# Altium project BraaiBuddyPCB.PrjPcb (part 2 of 2)
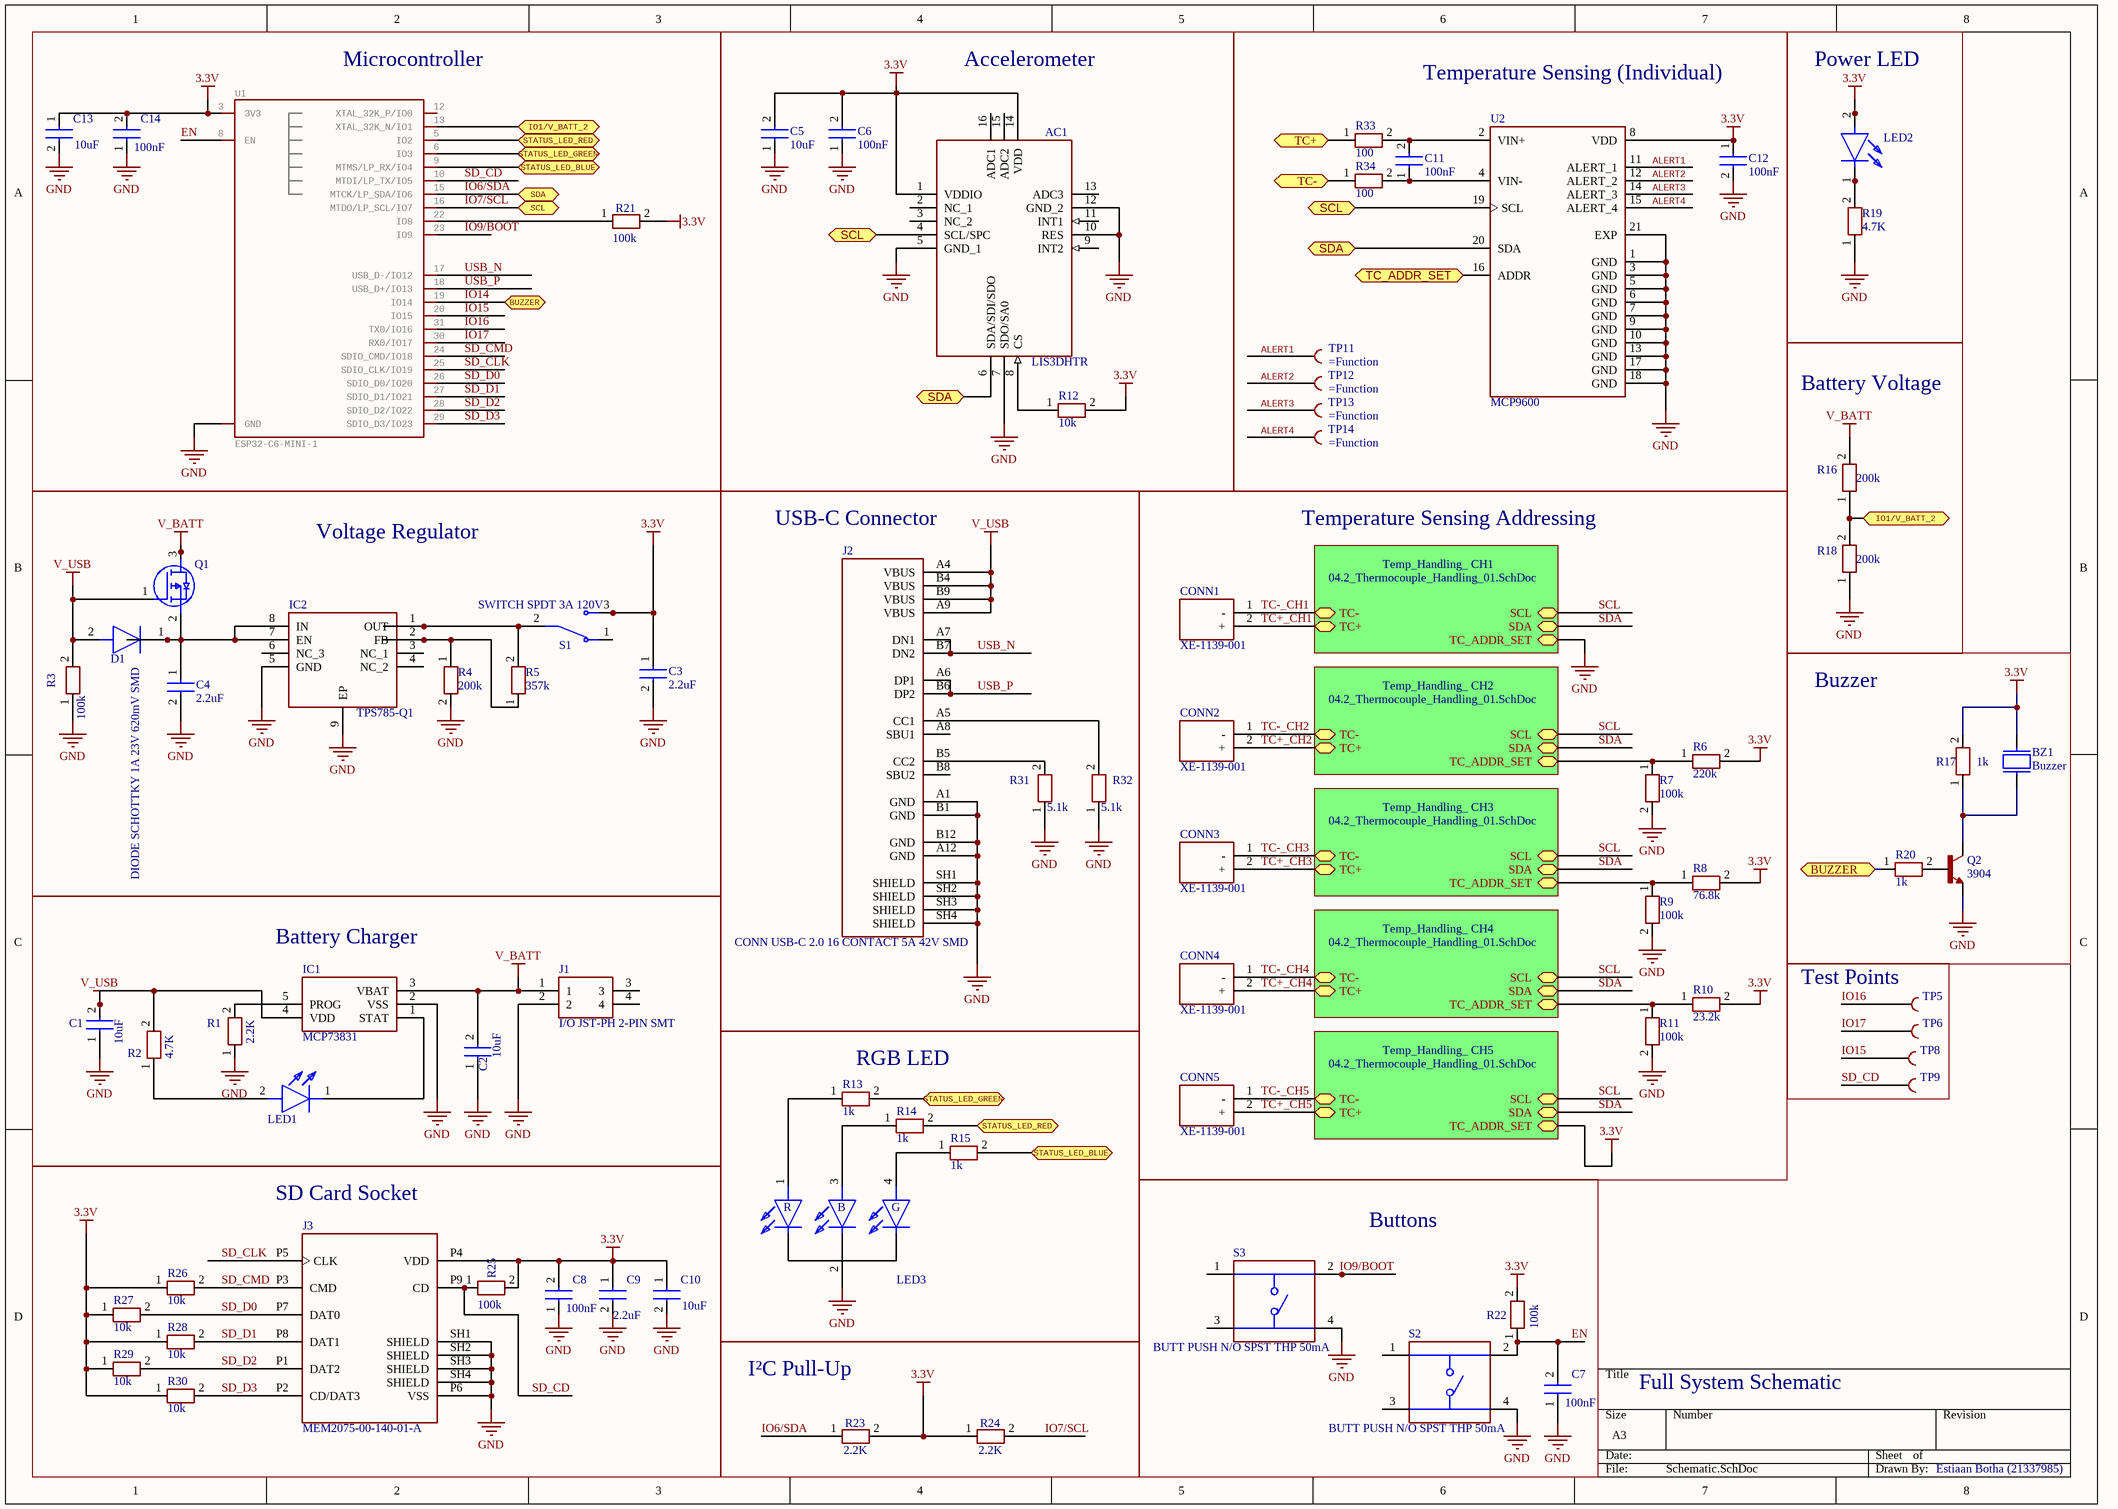
[diagram p9: Schematic.SchDoc]

## Nets that join several sheets
3.3V: 06_MCU (17 pins), 03_Temp_Sensor (R6#1.2 R8#1.2 R10#1.2), Temperature Sensor Interface/Temp_Handling_ CH1 (C12.1.1 U2.1.8), Temperature Sensor Interface/Temp_Handling_ CH2 (C12.2.1 U2.2.8), Temperature Sensor Interface/Temp_Handling_ CH3 (C12.3.1 U2.3.8), Temperature Sensor Interface/Temp_Handling_ CH4 (C12.4.1 U2.4.8), Temperature Sensor Interface/Temp_Handling_ CH5 (C12.5.1 U2.5.8 U2.5.16), 04_Accelerometer (5 pins), 02_Power (C3#1.1 S1#1.3), 05_Human_Interaction (BZ1#1.2 LED2#1.2 R17#1.2), Schematic (32 pins), Temp_Handling_ CH1 (C12.6.1 U2.6.8), Temp_Handling_ CH2 (C12.7.1 U2.7.8), Temp_Handling_ CH3 (C12.8.1 U2.8.8), Temp_Handling_ CH4 (C12.9.1 U2.9.8), Temp_Handling_ CH5 (C12.10.1 U2.10.8 U2.10.16)
GND: 06_MCU (24 pins), 03_Temp_Sensor (R7#1.2 R9#1.2 R11#1.2), Temperature Sensor Interface/Temp_Handling_ CH1 (13 pins), Temperature Sensor Interface/Temp_Handling_ CH2 (12 pins), Temperature Sensor Interface/Temp_Handling_ CH3 (12 pins), Temperature Sensor Interface/Temp_Handling_ CH4 (12 pins), Temperature Sensor Interface/Temp_Handling_ CH5 (12 pins), 04_Accelerometer (6 pins), 02_Power (11 pins), 05_Human_Interaction (LED3#1.2 Q2#1.E R18#1.1 R19#1.1), Schematic (60 pins), Temp_Handling_ CH1 (13 pins), Temp_Handling_ CH2 (12 pins), Temp_Handling_ CH3 (12 pins), Temp_Handling_ CH4 (12 pins), Temp_Handling_ CH5 (12 pins)
V_BATT: 02_Power (C2#1.2 IC1#1.3 J1#1.1 Q1#1.3), 05_Human_Interaction (R16#1.2), Schematic (5 pins)
V_USB: 06_MCU (J2#1.A4 J2#1.A9 J2#1.B4 J2#1.B9), 02_Power (6 pins), Schematic (10 pins)
IO6/SDA: 06_MCU (R23#1.1 U1#1.15), Temperature Sensor Interface/Temp_Handling_ CH1 (U2.1.20), Temperature Sensor Interface/Temp_Handling_ CH2 (U2.2.20), Temperature Sensor Interface/Temp_Handling_ CH3 (U2.3.20), Temperature Sensor Interface/Temp_Handling_ CH4 (U2.4.20), Temperature Sensor Interface/Temp_Handling_ CH5 (U2.5.20), 04_Accelerometer (AC1#1.6)
IO7/SCL: 06_MCU (R24#1.2 U1#1.16), Temperature Sensor Interface/Temp_Handling_ CH1 (U2.1.19), Temperature Sensor Interface/Temp_Handling_ CH2 (U2.2.19), Temperature Sensor Interface/Temp_Handling_ CH3 (U2.3.19), Temperature Sensor Interface/Temp_Handling_ CH4 (U2.4.19), Temperature Sensor Interface/Temp_Handling_ CH5 (U2.5.19), 04_Accelerometer (AC1#1.4)
IO14: 06_MCU (U1#1.19), 05_Human_Interaction (R20#1.1)
NetR6#1_1: 03_Temp_Sensor (R6#1.1 R7#1.1), Temperature Sensor Interface/Temp_Handling_ CH2 (U2.2.16)
NetR6#2_1: Schematic (R6#2.1 R7#2.1), Temp_Handling_ CH2 (U2.7.16)
NetR8#1_1: 03_Temp_Sensor (R8#1.1 R9#1.1), Temperature Sensor Interface/Temp_Handling_ CH3 (U2.3.16)
NetR8#2_1: Schematic (R8#2.1 R9#2.1), Temp_Handling_ CH3 (U2.8.16)
NetR10#1_1: 03_Temp_Sensor (R10#1.1 R11#1.1), Temperature Sensor Interface/Temp_Handling_ CH4 (U2.4.16)
NetR10#2_1: Schematic (R10#2.1 R11#2.1), Temp_Handling_ CH4 (U2.9.16)
NetR13#1_2: 06_MCU (U1#1.6), 05_Human_Interaction (R13#1.2)
NetR14#1_2: 06_MCU (U1#1.5), 05_Human_Interaction (R14#1.2)
NetR15#1_2: 06_MCU (U1#1.9), 05_Human_Interaction (R15#1.2)
NetR16#1_1: 06_MCU (U1#1.13), 05_Human_Interaction (R16#1.1 R18#1.2)
SCL: Temp_Handling_ CH1 (U2.6.19), Temp_Handling_ CH2 (U2.7.19), Temp_Handling_ CH3 (U2.8.19), Temp_Handling_ CH4 (U2.9.19), Temp_Handling_ CH5 (U2.10.19)
SDA: Temp_Handling_ CH1 (U2.6.20), Temp_Handling_ CH2 (U2.7.20), Temp_Handling_ CH3 (U2.8.20), Temp_Handling_ CH4 (U2.9.20), Temp_Handling_ CH5 (U2.10.20)
TC+_CH1: 03_Temp_Sensor (CONN1#1.2), Temperature Sensor Interface/Temp_Handling_ CH1 (R33.1.1)
TC+_CH1: Schematic (CONN1#2.2), Temp_Handling_ CH1 (R33.6.1)
TC+_CH2: 03_Temp_Sensor (CONN2#1.2), Temperature Sensor Interface/Temp_Handling_ CH2 (R33.2.1)
TC+_CH2: Schematic (CONN2#2.2), Temp_Handling_ CH2 (R33.7.1)
TC+_CH3: 03_Temp_Sensor (CONN3#1.2), Temperature Sensor Interface/Temp_Handling_ CH3 (R33.3.1)
TC+_CH3: Schematic (CONN3#2.2), Temp_Handling_ CH3 (R33.8.1)
TC+_CH4: 03_Temp_Sensor (CONN4#1.2), Temperature Sensor Interface/Temp_Handling_ CH4 (R33.4.1)
TC+_CH4: Schematic (CONN4#2.2), Temp_Handling_ CH4 (R33.9.1)
TC+_CH5: 03_Temp_Sensor (CONN5#1.2), Temperature Sensor Interface/Temp_Handling_ CH5 (R33.5.1)
TC+_CH5: Schematic (CONN5#2.2), Temp_Handling_ CH5 (R33.10.1)
TC-_CH1: 03_Temp_Sensor (CONN1#1.1), Temperature Sensor Interface/Temp_Handling_ CH1 (R34.1.1)
TC-_CH1: Schematic (CONN1#2.1), Temp_Handling_ CH1 (R34.6.1)
TC-_CH2: 03_Temp_Sensor (CONN2#1.1), Temperature Sensor Interface/Temp_Handling_ CH2 (R34.2.1)
TC-_CH2: Schematic (CONN2#2.1), Temp_Handling_ CH2 (R34.7.1)
TC-_CH3: 03_Temp_Sensor (CONN3#1.1), Temperature Sensor Interface/Temp_Handling_ CH3 (R34.3.1)
TC-_CH3: Schematic (CONN3#2.1), Temp_Handling_ CH3 (R34.8.1)
TC-_CH4: 03_Temp_Sensor (CONN4#1.1), Temperature Sensor Interface/Temp_Handling_ CH4 (R34.4.1)
TC-_CH4: Schematic (CONN4#2.1), Temp_Handling_ CH4 (R34.9.1)
TC-_CH5: 03_Temp_Sensor (CONN5#1.1), Temperature Sensor Interface/Temp_Handling_ CH5 (R34.5.1)
TC-_CH5: Schematic (CONN5#2.1), Temp_Handling_ CH5 (R34.10.1)